# EAGLE board Protein (EAGLE 6.3), part 1 of 2
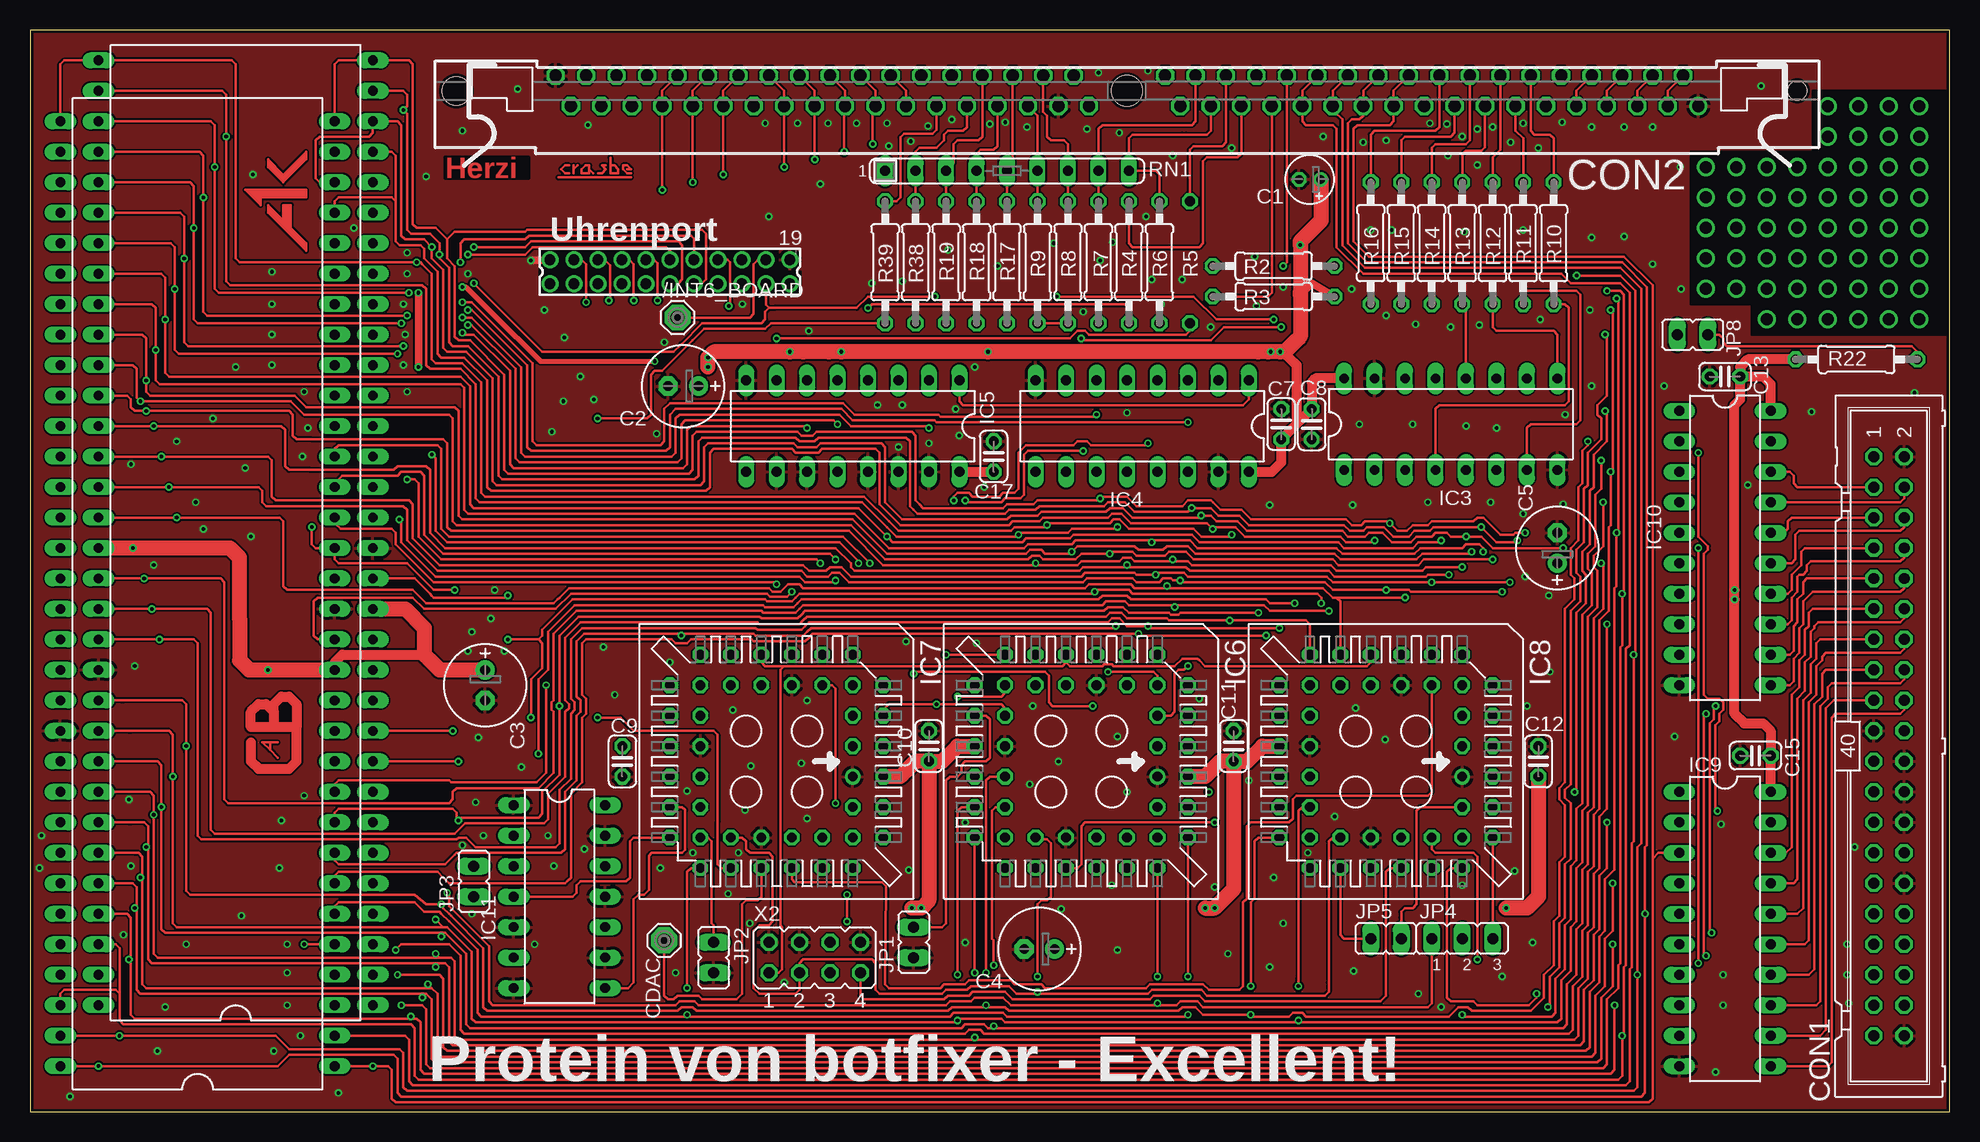
[diagram p6: board, top side]
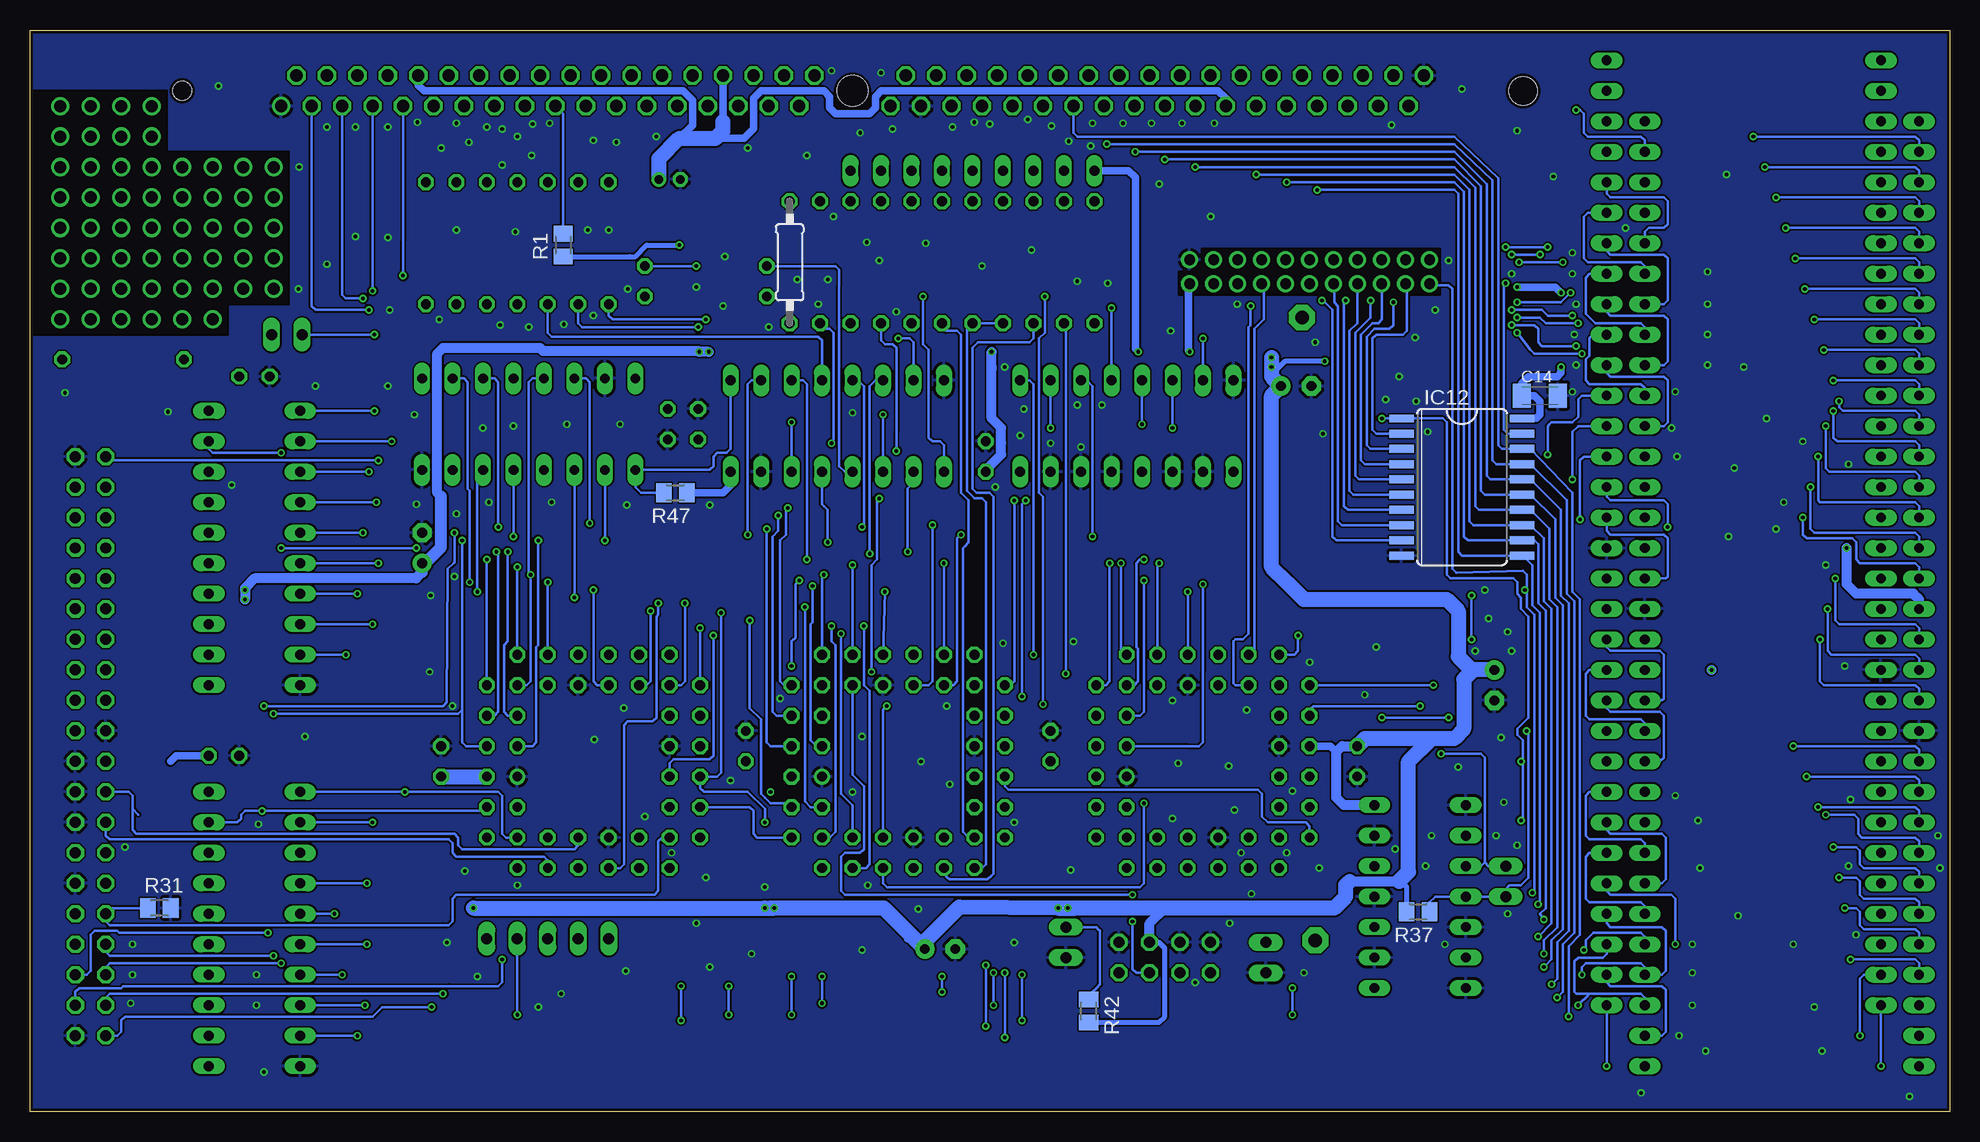
[diagram p7: board, bottom side, seen from below]

Size 160 x 90.16 mm. Coordinates in mm from the lower left corner, seen from the top.
Outline: 0,0 160,0 160,90.16 0,90.16 0,0
Copper layers (1*16): Top 0.035mm / dielectric 1.5mm / Bottom 0.035mm
Design rules "Fusion_eagle_rule_v1.1": minimum track width 6mil, minimum drill 12mil, track to track 6mil, track to pad 6mil, pad to pad 6mil, via to via 6mil, smd to smd 0mil, copper to edge 10mil, drill to drill 10mil, minimum pad ring 10mil, minimum via ring 6mil, stop-mask expansion 2mil, vias tented up to drill 100mil, thermal gap 10mil

## Footprints (pad centres in the part's own frame; a part is rotated, then mirrored left to right if it is on the bottom)
SE11 = drill 1.118 pad 2.159 octagon: MP 0,0
E1,8-4 = drill 0.711 pad 1.168: + -0.889,0 | drill 0.711 pad 1.168 octagon: - 0.889,0
E2,5-7 = drill 0.813 pad 1.6: + -1.27,0 | drill 0.813 pad 1.6 octagon: - 1.27,0
C025-024X044 = drill 0.813 octagon: 1 -1.27,0; 2 1.27,0
C1206K = smd 1.5 x 2: 1 -1.5,0; 2 1.5,0
ML40 = drill 0.914 octagon: 1 -24.13,-1.27; 2 -24.13,1.27; 3 -21.59,-1.27; 4 -21.59,1.27; 5 -19.05,-1.27; 6 -19.05,1.27; 7 -16.51,-1.27; 8 -16.51,1.27; 9 -13.97,-1.27; 10 -13.97,1.27; 11 -11.43,-1.27; 12 -11.43,1.27; 13 -8.89,-1.27; 14 -8.89,1.27; 15 -6.35,-1.27; 16 -6.35,1.27; 17 -3.81,-1.27; 18 -3.81,1.27; 19 -1.27,-1.27; 20 -1.27,1.27; 21 1.27,-1.27; 22 1.27,1.27; 23 3.81,-1.27; 24 3.81,1.27; 25 6.35,-1.27; 26 6.35,1.27; 27 8.89,-1.27; 28 8.89,1.27; 29 11.43,-1.27; 30 11.43,1.27; 31 13.97,-1.27; 32 13.97,1.27; 33 16.51,-1.27; 34 16.51,1.27; 35 19.05,-1.27; 36 19.05,1.27; 37 21.59,-1.27; 38 21.59,1.27; 39 24.13,-1.27; 40 24.13,1.27
73826962 = drill 1.016: 1 47.625,-1.27 | drill 1.016 octagon: 2 46.355,1.27; 3 45.085,-1.27; 4 43.815,1.27; 5 42.545,-1.27; 6 41.275,1.27; 7 40.005,-1.27; 8 38.735,1.27; 9 37.465,-1.27; 10 36.195,1.27; 11 34.925,-1.27; 12 33.655,1.27; 13 32.385,-1.27; 14 31.115,1.27; 15 29.845,-1.27; 16 28.575,1.27; 17 27.305,-1.27; 18 26.035,1.27; 19 24.765,-1.27; 20 23.495,1.27; 21 22.225,-1.27; 22 20.955,1.27; 23 19.685,-1.27; 24 18.415,1.27; 25 17.145,-1.27; 26 15.875,1.27; 27 14.605,-1.27; 28 13.335,1.27; 29 12.065,-1.27; 30 10.795,1.27; 31 9.525,-1.27; 32 8.255,1.27; 33 6.985,-1.27; 34 5.715,1.27; 35 4.445,-1.27; 36 3.175,1.27; 37 -3.175,-1.27; 38 -4.445,1.27; 39 -5.715,-1.27; 40 -6.985,1.27; 41 -8.255,-1.27; 42 -9.525,1.27; 43 -10.795,-1.27; 44 -12.065,1.27; 45 -13.335,-1.27; 46 -14.605,1.27; 47 -15.875,-1.27; 48 -17.145,1.27; 49 -18.415,-1.27; 50 -19.685,1.27; 51 -20.955,-1.27; 52 -22.225,1.27; 53 -23.495,-1.27; 54 -24.765,1.27; 55 -26.035,-1.27; 56 -27.305,1.27; 57 -28.575,-1.27; 58 -29.845,1.27; 59 -31.115,-1.27; 60 -32.385,1.27; 61 -33.655,-1.27; 62 -34.925,1.27; 63 -36.195,-1.27; 64 -37.465,1.27; 65 -38.735,-1.27; 66 -40.005,1.27; 67 -41.275,-1.27; 68 -42.545,1.27; 69 -43.815,-1.27; 70 -45.085,1.27; 71 -46.355,-1.27; 72 -47.625,1.27 | hole 2.362: -55.88,0 | hole 1.575: 55.88,0 | hole 2.54: 0,0
DIL64 = drill 0.813 long: 1 -39.37,-11.43; 2 -36.83,-11.43; 3 -34.29,-11.43; 4 -31.75,-11.43; 5 -29.21,-11.43; 6 -26.67,-11.43; 7 -24.13,-11.43; 8 -21.59,-11.43; 9 -19.05,-11.43; 10 -16.51,-11.43; 11 -13.97,-11.43; 12 -11.43,-11.43; 13 -8.89,-11.43; 14 -6.35,-11.43; 15 -3.81,-11.43; 16 -1.27,-11.43; 17 1.27,-11.43; 18 3.81,-11.43; 19 6.35,-11.43; 20 8.89,-11.43; 21 11.43,-11.43; 22 13.97,-11.43; 23 16.51,-11.43; 24 19.05,-11.43; 25 21.59,-11.43; 26 24.13,-11.43; 27 26.67,-11.43; 28 29.21,-11.43; 29 31.75,-11.43; 30 34.29,-11.43; 31 36.83,-11.43; 32 39.37,-11.43; 33 39.37,11.43; 34 36.83,11.43; 35 34.29,11.43; 36 31.75,11.43; 37 29.21,11.43; 38 26.67,11.43; 39 24.13,11.43; 40 21.59,11.43; 41 19.05,11.43; 42 16.51,11.43; 43 13.97,11.43; 44 11.43,11.43; 45 8.89,11.43; 46 6.35,11.43; 47 3.81,11.43; 48 1.27,11.43; 49 -1.27,11.43; 50 -3.81,11.43; 51 -6.35,11.43; 52 -8.89,11.43; 53 -11.43,11.43; 54 -13.97,11.43; 55 -16.51,11.43; 56 -19.05,11.43; 57 -21.59,11.43; 58 -24.13,11.43; 59 -26.67,11.43; 60 -29.21,11.43; 61 -31.75,11.43; 62 -34.29,11.43; 63 -36.83,11.43; 64 -39.37,11.43
DIL16 = drill 0.813 long: 1 -8.89,-3.81; 2 -6.35,-3.81; 3 -3.81,-3.81; 4 -1.27,-3.81; 5 1.27,-3.81; 6 3.81,-3.81; 7 6.35,-3.81; 8 8.89,-3.81; 9 8.89,3.81; 10 6.35,3.81; 11 3.81,3.81; 12 1.27,3.81; 13 -1.27,3.81; 14 -3.81,3.81; 15 -6.35,3.81; 16 -8.89,3.81
PLCC-S44 = drill 0.813: 1 1.27,6.35 | drill 0.813 octagon: 2 -1.27,8.89; 3 -1.27,6.35; 4 -3.81,8.89; 5 -3.81,6.35; 6 -6.35,8.89; 7 -8.89,6.35; 8 -6.35,6.35; 9 -8.89,3.81; 10 -6.35,3.81; 11 -8.89,1.27; 12 -6.35,1.27; 13 -8.89,-1.27; 14 -6.35,-1.27; 15 -8.89,-3.81; 16 -6.35,-3.81; 17 -8.89,-6.35; 18 -6.35,-8.89; 19 -6.35,-6.35; 20 -3.81,-8.89; 21 -3.81,-6.35; 22 -1.27,-8.89; 23 -1.27,-6.35; 24 1.27,-8.89; 25 1.27,-6.35; 26 3.81,-8.89; 27 3.81,-6.35; 28 6.35,-8.89; 29 8.89,-6.35; 30 6.35,-6.35; 31 8.89,-3.81; 32 6.35,-3.81; 33 8.89,-1.27; 34 6.35,-1.27; 35 8.89,1.27; 36 6.35,1.27; 37 8.89,3.81; 38 6.35,3.81; 39 8.89,6.35; 40 6.35,8.89; 41 6.35,6.35; 42 3.81,8.89; 43 3.81,6.35; 44 1.27,8.89
DIL20 = drill 0.813 long: 1 -11.43,-3.81; 2 -8.89,-3.81; 3 -6.35,-3.81; 4 -3.81,-3.81; 5 -1.27,-3.81; 6 1.27,-3.81; 7 3.81,-3.81; 8 6.35,-3.81; 9 8.89,-3.81; 10 11.43,-3.81; 11 11.43,3.81; 12 8.89,3.81; 13 6.35,3.81; 14 3.81,3.81; 15 1.27,3.81; 16 -1.27,3.81; 17 -3.81,3.81; 18 -6.35,3.81; 19 -8.89,3.81; 20 -11.43,3.81
DIL14 = drill 0.813 long: 1 -7.62,-3.81; 2 -5.08,-3.81; 3 -2.54,-3.81; 4 0,-3.81; 5 2.54,-3.81; 6 5.08,-3.81; 7 7.62,-3.81; 8 7.62,3.81; 9 5.08,3.81; 10 2.54,3.81; 11 0,3.81; 12 -2.54,3.81; 13 -5.08,3.81; 14 -7.62,3.81
SO20W = smd 0.66 x 2.032: 1 -5.715,-5.029; 2 -4.445,-5.029; 3 -3.175,-5.029; 4 -1.905,-5.029; 5 -0.635,-5.029; 6 0.635,-5.029; 7 1.905,-5.029; 8 3.175,-5.029; 9 4.445,-5.029; 10 5.715,-5.029; 11 5.715,5.029; 12 4.445,5.029; 13 3.175,5.029; 14 1.905,5.029; 15 0.635,5.029; 16 -0.635,5.029; 17 -1.905,5.029; 18 -3.175,5.029; 19 -4.445,5.029; 20 -5.715,5.029
JP1 = drill 0.914 long: 1 0,-1.27; 2 0,1.27
JP2 = drill 0.914 long: 1 -2.54,0; 2 0,0; 3 2.54,0
M0805 = smd 1.3 x 1.6: 1 -0.95,0; 2 0.95,0
0207/10 = drill 0.813 octagon: 1 -5.08,0; 2 5.08,0
SIL9 = drill 0.813 long: 1 -10.16,0; 2 -7.62,0; 3 -5.08,0; 4 -2.54,0; 5 0,0; 6 2.54,0; 7 5.08,0; 8 7.62,0; 9 10.16,0
BREAD = drill 1: P$1 0,0; P$2 0,2.54
87758-2216 = drill 0.9 pad 1.27: 1 -10,-1; 2 -10,1; 3 -8,-1; 4 -8,1; 5 -6,-1; 6 -6,1; 7 -4,-1; 8 -4,1; 9 -2,-1; 10 -2,1; 11 0,-1; 12 0,1; 13 2,-1; 14 2,1; 15 4,-1; 16 4,1; 17 6,-1; 18 6,1; 19 8,-1; 20 8,1; 21 10,-1; 22 10,1
JP4Q = drill 0.914 octagon: 1 -3.81,-1.27; 2 -3.81,1.27; 3 -1.27,-1.27; 4 -1.27,1.27; 5 1.27,-1.27; 6 1.27,1.27; 7 3.81,-1.27; 8 3.81,1.27

## Placement (x,y rotation side)
/INT6_BOARD  SE11  [SE11]  53.98,66.2 0 top
C1  [E1,8-4]  106.68,77.71 180 top
C2  [E2,5-7]  54.45,60.48 180 top
C3  [E2,5-7]  37.94,35.56 270 top
C4  [E2,5-7]  84.14,13.57 180 top
C5  [E2,5-7]  127.32,46.99 90 top
C7  100n  [C025-024X044]  104.3,57.31 90 top
C8  100n  [C025-024X044]  106.84,57.31 270 top
C9  100n  [C025-024X044]  49.37,29.21 270 top
C10  100n  [C025-024X044]  74.93,30.48 90 top
C11  100n  [C025-024X044]  100.33,30.48 90 top
C12  100n  [C025-024X044]  125.73,29.21 90 top
C13  100n  [C025-024X044]  141.29,61.28 180 top
C14  100n  [C1206K]  34.13,59.69 0 bottom
C15  100n  [C025-024X044]  143.83,29.69 0 top
C17  100n  [C025-024X044]  80.33,54.61 90 top
CDAC_BOARD  SE11  [SE11]  52.86,14.29 180 top
CON1  [ML40]  154.94,30.48 270 top
CON2  [73826962]  91.44,85.09 0 top
IC1  [DIL64]  17.14,48.26 90 top
IC2  [DIL64]  13.97,43.18 90 top
IC3  74LS157N  [DIL16]  118.43,57.31 0 top
IC4  74LS157N  [DIL16]  92.71,57.15 180 top
IC5  74LS157N  [DIL16]  68.58,57.15 180 top
IC6  M4A5_64/32  [PLCC-S44]  87.63,29.21 270 top
IC7  M4A5_64/32  [PLCC-S44]  62.23,29.21 270 top
IC8  M4A5_64/32  [PLCC-S44]  113.03,29.21 270 top
IC9  74LS245N  [DIL20]  141.29,15.24 270 top
IC10  74LS245N  [DIL20]  141.29,46.99 270 top
IC11  7407  [DIL14]  44.13,17.94 270 top
IC12  74LS245DW  [SO20W]  40.64,52.07 270 bottom
JP1  [JP1]  73.66,14.13 0 top
JP2  [JP1]  56.99,12.86 180 top
JP3  [JP1]  36.99,19.21 0 top
JP4  [JP2]  119.38,14.45 0 top
JP5  [JP1]  113.03,14.45 270 top
JP8  [JP1]  138.59,64.77 90 top
R1  [M0805]  115.57,72.23 90 bottom
R2  33R  [0207/10]  103.66,70.48 0 top
R3  33R  [0207/10]  103.66,67.94 180 top
R4  33R  [0207/10]  91.6,70.8 90 top
R5  33R  [0207/10]  96.68,70.8 90 bottom
R6  33R  [0207/10]  94.14,70.8 90 top
R7  33R  [0207/10]  89.06,70.8 90 top
R8  33R  [0207/10]  86.52,70.8 90 top
R9  33R  [0207/10]  83.98,70.8 90 top
R10  33R  [0207/10]  127,72.39 90 top
R11  33R  [0207/10]  124.46,72.39 90 top
R12  33R  [0207/10]  121.92,72.39 90 top
R13  33R  [0207/10]  119.38,72.39 90 top
R14  33R  [0207/10]  116.84,72.39 90 top
R15  33R  [0207/10]  114.3,72.39 90 top
R16  33R  [0207/10]  111.76,72.39 90 top
R17  33R  [0207/10]  81.44,70.8 90 top
R18  33R  [0207/10]  78.9,70.8 90 top
R19  33R  [0207/10]  76.36,70.8 90 top
R22  4K7  [0207/10]  152.24,62.71 0 top
R31  4K7  [M0805]  149.22,16.99 0 bottom
R37  4K7  [M0805]  44.29,16.67 180 bottom
R38  33R  [0207/10]  73.82,70.8 90 top
R39  33R  [0207/10]  71.28,70.8 90 top
R42  4K7  [M0805]  71.75,8.41 270 bottom
R47  4K7  [M0805]  106.2,51.59 180 bottom
RN1  [SIL9]  81.44,78.42 0 top
U$1  A1K  [A1K]  21.11,76.2 90 top
U$2  CRASBE  [CRASBE]  47.15,78.74 0 top
U$3  CAB  [CAB-LOGO]  20,31.43 90 top
U$4  BREAD_2  [BREAD]  157.48,81.28 0 top
U$5  BREAD_2  [BREAD]  152.4,76.2 0 top
U$6  BREAD_2  [BREAD]  152.4,81.28 0 top
U$7  BREAD_2  [BREAD]  149.86,81.28 0 top
U$8  BREAD_2  [BREAD]  154.94,76.2 0 top
U$9  BREAD_2  [BREAD]  154.94,71.12 0 top
U$10  BREAD_2  [BREAD]  157.48,71.12 0 top
U$11  BREAD_2  [BREAD]  157.48,76.2 0 top
U$12  BREAD_2  [BREAD]  154.94,81.28 0 top
U$13  BREAD_2  [BREAD]  152.4,71.12 0 top
U$14  BREAD_2  [BREAD]  149.86,76.2 0 top
U$15  BREAD_2  [BREAD]  147.32,76.2 0 top
U$16  BREAD_2  [BREAD]  139.7,71.12 0 top
U$17  BREAD_2  [BREAD]  144.78,76.2 0 top
U$18  BREAD_2  [BREAD]  149.86,71.12 0 top
U$19  BREAD_2  [BREAD]  144.78,71.12 0 top
U$20  BREAD_2  [BREAD]  147.32,71.12 0 top
U$21  BREAD_2  [BREAD]  142.24,71.12 0 top
U$22  BREAD_2  [BREAD]  152.4,68.58 90 top
U$23  BREAD_2  [BREAD]  147.32,66.04 90 top
U$24  BREAD_2  [BREAD]  147.32,68.58 90 top
U$25  BREAD_2  [BREAD]  152.4,66.04 90 top
U$26  BREAD_2  [BREAD]  157.48,66.04 90 top
U$27  BREAD_2  [BREAD]  142.24,76.2 0 top
U$28  BREAD_2  [BREAD]  139.7,76.2 0 top
U$29  BREAD_2  [BREAD]  157.48,68.58 90 top
U$30  BREAD_2  [BREAD]  142.24,68.58 90 top
X1  87758-2216  [87758-2216]  53.34,70.01 180 top
X2  JTAG  [JP4Q]  65.41,12.86 0 top

## Tracks (layer width: path | path; a pad name or v marks a point on that pad's centre or on a via)
+5V  (via drill 0.3)
  Top 0.406: 74.77,29.05 C10.1 | v105.89,72.23 105.89,68.26 | v36.04,68.74 36.35,68.74 38.58,66.52 42.55,62.55 v52.07,62.55
  Top 0.61: v67.63,63.34 66.6,63.34 | R3.1 106.84,69.06 105.89,68.1 | v32.38,62.07 v32.38,68.26
  Top 0.813: IC9.20 C15.2 145.1,31.75 144.46,32.38 142.88,32.38 142.08,33.18 v142.08,42.7 v142.08,43.5 142.08,58.9 142.56,59.37 C13.1 | IC10.20 145.1,60.64 144.46,61.28 C13.1 | IC4.16 103.5,53.34 104.3,54.13 C7.1 105.33,57.07 | IC3.16 107.16,61.12 106.84,60.8 C8.1 105.33,57.07 | R22.1 143.19,62.71 142.56,62.07 C13.1 | IC5.16 C17.1 | 103.19,63.34 v104.22,63.34 104.46,63.34 105.41,62.39 105.57,62.23 105.57,57.31 105.33,57.07 | v19.84,36.83 21.51,36.83 | v8.57,46.99 13.81,46.99 | IC2.14 25.4,37.47 26.04,38.1 32.86,38.1 33.26,37.7
  Top 1.27: IC2.14 21.51,36.83 v19.84,36.83 18.26,36.83 17.46,37.62 17.46,41.12 17.46,46.2 16.67,46.99 13.81,46.99 v8.57,46.99 IC1.49 | C12.1 125.73,17.94 124.78,16.99 v123.03,16.99 | C11.1 100.33,18.57 v98.74,16.99 v97.95,16.99 | C10.1 74.93,17.62 v74.3,16.99 v73.5,16.99 | C10.1 73.82,29.21 73.03,28.42 72.55,27.94 IC7.44 | C10.1 76.04,29.21 77.31,30.48 IC6.22 | C11.1 99.22,29.21 97.95,27.94 IC6.44 | C11.1 101.44,29.21 102.71,30.48 IC8.22 | v56.52,62.07 v56.52,62.87 56.99,63.34 v63.34,63.34 64.45,63.34 66.6,63.34 v67.63,63.34 v79.85,63.34 102.39,63.34 103.19,63.34 v104.22,63.34 104.62,63.34 105.57,64.29 105.89,64.61 105.89,68.1 105.89,68.26 v105.89,72.23 105.89,72.55 107.63,74.3 107.63,74.61 107.63,77.64 C1.+ | IC1.14 31.27,41.91 32.86,40.32 32.86,38.1 33.26,37.7 34.13,36.83 C3.+
  Bottom 0.203: 63.45,68.9 X1.2
  Bottom 0.406: 65.41,7.93 65.41,7.94 | 65.41,7.94 65.41,10.95 65.41,13.65 65.88,14.13 X2.6 | R1.1 110.02,71.28 109.54,71.28 108.58,72.23 v105.89,72.23 | R42.2 65.88,7.46 65.41,7.94 | R37.2 45.24,18.73 45.8,19.29 | v52.07,62.55 55.4,62.55 56.52,61.44
  Bottom 0.61: IC12.20 34.45,57.78 34.13,58.1 34.13,59.21 34.61,59.69 C14.1 35.63,60.73 35.08,61.28 32.7,61.28 32.38,61.59 v32.38,62.07 | R47.1 102.23,51.59 101.6,52.23 IC4.16 | CON2.10 127.64,85.57 127.16,85.09 105.73,85.09 105.57,85.09 104.78,84.3 104.78,82.23 105.89,81.12 | CON2.59 60.33,84.45 60.96,85.09 89.06,85.09 89.53,84.61 89.53,84.3 89.53,83.66 90.01,83.19 90.17,83.19 92.87,83.19 93.34,83.66 93.34,84.61 93.82,85.09 98.42,85.09 99.06,85.09 99.69,84.45 99.69,81.92 100.49,81.12 104.14,81.12 | IC7.22 51.59,30.48 51.12,30 | CON2.30 102.23,82.55 | 86.84,14.45 86.56,14.72 | v67.63,63.34 67.87,63.58 67.87,77.87 68.42,78.42 RN1.1 | 148.28,29.21 147.8,29.69 C15.2 | 63.45,68.9 63.45,63.45 v63.34,63.34 | v32.38,68.26 32.86,68.74 33.02,68.74 v36.04,68.74
  Bottom 0.813: IC11.14 50.48,25.56 51.12,26.19 51.12,30 50.64,30.48 C9.1 | C5.+ 127.32,45.01 127.79,44.45 141.29,44.45 142.08,43.66 v142.08,43.5 v142.08,42.7 | 50.01,19.21 45.88,19.21 | X2.6 66.67,15.72 65.41,16.99 | v79.85,63.34 79.85,62.07 79.85,61.91 79.85,57.78 79.06,56.99 79.06,55.72 79.06,54.77 80.33,53.5 C17.1 | v103.43,63.34 v104.22,63.34 104.3,63.42 117.24,63.42 117.47,63.66 125.57,63.66 126.05,63.18 126.05,51.59 125.73,51.28 | v19.85,36.83 v19.84,36.83 | IC2.49 2.54,42.7 3.02,43.18 7.78,43.18 8.57,43.97 v8.57,46.99
  Bottom 1.016: 127.32,45.01 127.32,45.48 125.73,47.07 125.73,51.28
  Bottom 1.27: C3.+ 39.69,36.83 39.77,36.75 | 39.77,36.75 40.48,36.04 40.48,31.91 41.27,31.11 43.18,31.11 | 43.18,31.11 48.74,31.11 C9.1 | C12.1 IC8.44 | v123.03,16.99 v98.74,16.99 | v98.74,16.99 98.27,16.99 | 98.27,16.99 v97.95,16.99 88.9,16.99 88.82,16.99 86.56,14.72 C4.+ 85.41,14.21 82.55,17.07 v74.3,16.99 | 50.01,19.21 50.32,18.89 50.32,17.94 51.28,16.99 65.41,16.99 72.87,16.99 | 45.88,19.21 45.8,19.29 45.09,20 45.09,29.21 43.18,31.11 | v98.74,16.99 98.27,16.99 | 72.87,16.99 v73.5,16.99 | v73.5,16.99 v74.3,16.99 | v74.3,16.99 v73.5,16.99 | v73.5,16.99 72.87,16.99 | v56.52,62.87 v56.52,62.07 56.52,61.44 56.52,61.28 C2.+ 56.52,59.69 56.52,45.4 55.24,44.13 53.82,42.7 41.91,42.7 40.96,41.75 40.96,37.94 39.77,36.75 | 102.23,82.55 102.23,81.76 102.87,81.12 104.14,81.12 105.89,81.12 107.57,79.44 C1.+
A1  (via drill 0.3)
  Top 0.203: 30.48,75.88 30.48,79.69 30.16,80.01 IC1.29 | 30.48,75.88 30.48,72.55 30.8,72.23 32.54,72.23 32.86,71.91 32.86,71.12 33.97,70.01 33.97,63.18 34.29,62.87 36.2,62.87 38.1,60.96 38.1,52.07 38.42,51.75 56.36,51.75 56.67,52.07 56.67,54.93 56.99,55.24 63.5,55.24 63.82,54.93 65.72,54.93 66.04,55.24 70.48,55.24 70.8,54.93 70.8,50.64 72.55,48.9 81.6,48.9 81.92,49.21 84.14,49.21 84.45,49.53 85.25,49.53 85.41,49.53 89.85,49.53 90.17,49.85 90.96,49.85 91.76,49.05 98.11,49.05 v98.58,48.58 98.74,48.74 100.49,48.74 101.28,47.94 109.22,47.94 109.7,47.47 111.92,47.47 v112.08,47.62 | IC2.29 25.4,75.88 25.72,76.2 30.16,76.2 30.48,75.88
  Bottom 0.203: v98.58,48.58 98.58,30.8 98.27,30.48 IC6.2 | v112.08,47.62 IC3.2
A2  (via drill 0.3)
  Top 0.203: v127.79,46.99 121.92,46.99 120.97,47.94 v119.7,47.94 118.43,47.94 118.11,48.26 117.16,48.26 116.84,47.94 115.57,47.94 115.09,47.47 113.51,47.47 112.71,48.26 111.6,48.26 111.28,47.94 109.86,47.94 109.38,48.42 101.44,48.42 100.65,49.21 98.9,49.21 98.42,49.69 v97.63,49.69 97.47,49.53 91.92,49.53 91.12,50.32 90.01,50.32 89.69,50.01 85.57,50.01 85.41,50.01 84.3,50.01 83.98,49.69 81.76,49.69 81.44,49.37 72.71,49.37 71.28,50.8 71.28,55.4 70.96,55.72 65.88,55.72 65.56,55.4 63.98,55.4 63.66,55.72 56.52,55.72 56.2,55.4 56.2,52.55 55.88,52.23 38.89,52.23 38.58,52.55 38.58,61.12 36.35,63.34 34.77,63.34 34.45,63.66 34.45,70.17 33.5,71.12 33.5,71.75 v33.5,72.07 32.86,72.71 31.27,72.71 30.96,73.03 30.96,82.23 30.64,82.55 IC1.30 28.57,81.6 28.26,81.28 24.13,81.28 23.81,80.96 23.81,77.79 24.13,77.47 IC2.30 | v139.06,46.99 v139.06,12.38 | v36.99,72.07 41.27,72.07 41.75,72.55 54.05,72.55 54.37,72.23 54.37,69.37 54.05,69.06 53.39,69.06 X1.12
  Bottom 0.203: v97.63,49.69 97.63,48.42 98.11,47.94 98.11,33.34 97.79,33.02 IC6.4 | IC3.5 v119.7,47.94 | v127.79,46.99 v139.06,46.99 | v139.06,12.38 153.35,12.38 153.67,12.06 CON1.35 | v36.99,72.07 v33.5,72.07
A3  (via drill 0.3)
  Top 0.203: v31.11,83.5 31.43,83.82 31.43,84.77 31.11,85.09 IC1.31 | v31.11,83.5 31.27,83.34 | 31.27,83.34 31.43,83.19 31.43,73.5 31.75,73.18 33.34,73.18 34.13,72.39 v34.13,71.44 34.13,71.12 34.92,70.33 34.92,64.14 35.24,63.82 36.51,63.82 39.05,61.28 39.05,53.02 39.37,52.7 55.4,52.7 55.72,53.02 55.72,55.88 56.04,56.2 63.82,56.2 64.14,55.88 65.41,55.88 65.72,56.2 73.03,56.2 73.34,55.88 73.34,50.48 73.66,50.16 73.98,49.85 81.28,49.85 81.6,50.16 83.82,50.16 84.14,50.48 85.57,50.48 85.72,50.48 89.53,50.48 89.85,50.8 91.28,50.8 92.08,50.01 96.52,50.01 v96.84,50.32 98.42,50.32 99.06,49.69 100.81,49.69 101.6,48.9 109.54,48.9 110.01,48.42 111.12,48.42 111.44,48.74 112.87,48.74 113.67,47.94 114.94,47.94 115.41,48.42 116.68,48.42 117,48.74 v120.97,48.74 122.24,47.47 123.83,47.47 v123.98,47.62 | v139.7,13.02 139.54,13.18 139.54,33.02 v139.7,33.18 | v36.51,71.44 41.27,71.44 41.91,72.07 53.02,72.07 53.34,71.75 X1.11 | v31.11,83.5 31.27,83.34
  Bottom 0.203: v123.98,47.62 123.98,33.5 | 123.98,33.5 123.98,30.8 123.67,30.48 IC8.2 | v120.97,48.74 120.97,60.8 121.28,61.12 IC3.11 | IC6.6 97.16,35.56 97.47,35.88 97.47,47.62 97,48.1 97,50.01 v96.84,50.32 | CON1.33 153.67,13.34 153.35,13.02 v139.7,13.02 | v139.7,33.18 124.3,33.18 123.98,33.5 | v36.51,71.44 v34.13,71.44 | IC2.31 25.4,80.96 25.72,81.28 30.16,81.28 30.48,81.6 30.48,83.19 30.8,83.5 v31.11,83.5
A4  (via drill 0.3)
  Top 0.203: IC6.8 93.98,36.35 93.66,36.67 v89.85,36.67 | v140.49,33.81 140.34,33.66 140.34,32.7 140.02,32.38 140.02,15.08 v140.18,14.92 | 34.77,72.71 33.81,73.66 32.23,73.66 31.91,73.98 31.91,87.31 31.59,87.63 IC1.32 25.72,87.63 25.4,87.31 IC2.32 | 34.77,72.71 34.77,71.12 35.4,70.48 35.4,64.61 35.72,64.29 36.67,64.29 39.53,61.44 39.53,53.5 39.85,53.18 54.93,53.18 55.24,53.5 55.24,56.36 55.56,56.67 63.98,56.67 64.29,56.36 65.25,56.36 65.56,56.67 73.5,56.67 73.82,56.36 73.82,50.96 74.14,50.64 74.45,50.32 81.12,50.32 81.44,50.64 83.66,50.64 83.98,50.96 85.72,50.96 85.88,50.96 89.06,50.96 v89.22,51.12 89.38,51.28 91.44,51.28 92.23,50.48 96.04,50.48 96.52,50.96 98.42,50.96 98.58,50.8 99.22,50.16 100.97,50.16 101.76,49.37 109.7,49.37 110.17,48.9 110.97,48.9 111.28,49.21 113.19,49.21 v113.35,49.05 113.98,48.42 114.78,48.42 115.25,48.9 116.52,48.9 116.84,49.21 120.33,49.21 120.65,49.53 121.13,49.53 122.56,48.1 123.67,48.1 123.83,48.26 v124.62,48.26 | 34.77,72.71 35.4,73.34 41.27,73.34 41.43,73.5 56.04,73.5 56.36,73.18 56.36,69.37 56.04,69.06 55.39,69.06 X1.10
  Bottom 0.203: v89.85,36.67 89.85,45.56 89.38,46.04 89.38,50.96 v89.22,51.12 | IC3.14 113.67,61.12 113.35,60.8 113.35,50.01 v113.35,49.05 | v140.49,33.81 125.57,33.81 125.25,34.13 125.17,45.24 124.7,45.72 124.62,45.8 v124.62,48.26 | v140.18,14.92 152.56,14.92 152.72,15.08 154.62,15.08 154.94,14.76 154.94,11.75 155.26,11.43 CON1.36
A5  (via drill 0.3)
  Top 0.203: v100.17,48.1 100.01,47.94 97.63,47.94 97,48.58 91.6,48.58 90.81,49.37 90.33,49.37 90.01,49.05 84.93,49.05 v84.77,48.9 84.61,48.74 82.07,48.74 81.76,48.42 72.39,48.42 71.6,49.21 69.53,51.28 37.94,51.28 37.62,51.59 37.62,60.8 36.04,62.39 33.81,62.39 33.5,62.71 33.5,69.85 32.7,70.64 32.54,70.8 v32.23,70.8 17.46,70.8 17.14,71.12 17.14,87.31 16.83,87.63 IC1.33 2.86,87.63 2.54,87.31 IC2.33 | v35.88,70.8 35.88,72.39 36.2,72.71 41.27,72.71 41.59,73.03 55.09,73.03 55.34,72.77 X1.9
  Bottom 0.203: v84.77,48.9 84.77,35.88 85.09,35.56 IC6.14 | v100.17,48.1 100.17,60.64 99.85,60.96 IC4.2 | v35.88,70.8 v32.23,70.8
A6  (via drill 0.3)
  Top 0.203: v16.35,81.28 16.35,84.77 16.03,85.09 IC1.34 | v16.35,81.28 16.35,80.96 | 16.35,80.96 16.35,69.22 16.67,68.9 32.7,68.9 33.02,68.58 33.02,62.23 33.34,61.91 35.88,61.91 37.15,60.64 37.15,51.12 37.47,50.8 69.37,50.8 71.44,48.74 72.23,47.94 82.23,47.94 v82.39,48.1 82.55,48.26 86.52,48.26 86.84,48.58 90.49,48.58 v90.65,48.74 | v16.35,81.28 16.35,80.96
  Bottom 0.203: v82.39,48.1 82.71,47.78 82.71,35.88 83.03,35.56 IC6.16 | v90.65,48.74 90.49,48.9 90.49,60.48 90.96,60.96 IC4.5 | IC2.34 2.54,80.96 2.86,81.28 v16.35,81.28
A7  (via drill 0.3)
  Top 0.203: v15.4,78.74 15.4,82.23 15.08,82.55 IC1.35 | v15.4,78.74 15.4,78.42 | 15.4,78.42 15.4,68.58 15.72,68.26 v31.59,68.26 | v88.9,58.1 88.74,57.94 75.88,57.94 75.72,58.1 68.74,58.1 67.79,59.05 53.34,59.05 52.86,58.58 52.86,55.88 52.55,55.56 42.23,55.56 41.91,55.88 41.91,62.39 36.83,67.47 v36.04,67.47 | v15.4,78.74 15.4,78.42
  Bottom 0.203: v31.59,68.26 32.38,67.47 v36.04,67.47 | IC4.11 v88.9,58.1 | IC2.35 2.54,78.42 2.86,78.74 v15.4,78.74
A8  (via drill 0.3)
  Top 0.203: v14.45,76.2 14.45,79.69 14.13,80.01 IC1.36 | v14.45,76.2 14.45,75.88 | 14.45,75.88 14.45,66.67 14.76,66.36 v31.43,66.36 | v36.51,66.83 36.83,66.83 41.43,62.23 41.43,55.4 41.75,55.09 53.02,55.09 53.34,55.4 53.34,58.1 53.82,58.58 67.63,58.58 68.58,57.63 75.41,57.63 75.56,57.47 v96.52,57.47 | v14.45,76.2 14.45,75.88
  Bottom 0.203: v31.43,66.36 33.5,66.36 33.97,66.83 v36.51,66.83 | v96.52,57.47 IC4.14 | IC2.36 2.54,75.88 2.86,76.2 v14.45,76.2
A9  (via drill 0.3)
  Top 0.203: v13.65,73.66 13.65,77.15 13.34,77.47 IC1.37 | v13.65,73.66 13.65,73.34 | 13.65,73.34 13.65,66.04 13.97,65.72 v30.96,65.72 | v36.04,66.2 36.83,66.2 40.96,62.07 40.96,54.93 41.27,54.61 53.5,54.61 53.82,54.93 53.82,57.78 54.13,58.1 67.47,58.1 68.42,57.15 74.77,57.15 v74.93,56.99 | v13.65,73.66 13.65,73.34
  Bottom 0.203: v30.96,65.72 33.66,65.72 34.13,66.2 v36.04,66.2 | v74.93,56.99 IC5.2 | IC2.37 2.54,73.34 2.86,73.66 v13.65,73.66
A10  (via drill 0.3)
  Top 0.203: v12.86,71.12 12.86,74.61 12.54,74.93 IC1.38 | v12.86,71.12 12.86,70.8 | 12.86,70.8 12.86,64.14 13.18,63.82 v31.11,63.82 | v36.51,65.56 36.83,65.56 40.48,61.91 40.48,54.45 40.8,54.13 53.98,54.13 54.29,54.45 54.29,57.31 54.61,57.63 66.99,57.63 v67.31,57.31 | v12.86,71.12 12.86,70.8
  Bottom 0.203: v31.11,63.82 33.97,63.82 34.29,64.14 34.29,65.25 34.61,65.56 v36.51,65.56 | v67.31,57.31 IC5.5 | IC2.38 2.54,70.8 2.86,71.12 v12.86,71.12
A11  (via drill 0.3)
  Top 0.203: v12.06,68.58 12.06,72.07 11.75,72.39 IC1.39 | v12.06,68.58 12.06,68.42 | 12.06,68.42 12.06,63.5 12.38,63.18 v30.64,63.18 | v36.04,64.93 36.2,64.77 36.99,64.77 40.01,61.75 40.01,53.98 40.32,53.66 54.45,53.66 54.77,53.98 54.77,56.83 55.09,57.15 64.61,57.15 v64.77,56.99 | v12.06,68.58 12.06,68.42
  Bottom 0.203: v30.64,63.18 34.61,63.18 34.92,63.5 v36.04,64.93 | v64.77,56.99 IC5.6 | IC2.39 2.54,68.26 2.86,68.58 v12.06,68.58
A12  (via drill 0.3)
  Top 0.203: v11.27,66.04 11.27,69.53 10.95,69.85 IC1.40 | v11.27,66.04 11.27,65.72 | 11.27,65.72 11.27,61.59 11.59,61.28 35.88,61.28 36.67,60.48 36.67,50.64 36.99,50.32 69.06,50.32 v71.44,47.94 71.6,47.78 71.91,47.47 82.71,47.47 83.03,47.78 86.68,47.78 87,48.1 96.84,48.1 97.47,47.47 109.06,47.47 109.54,46.99 115.25,46.99 115.73,47.47 117.47,47.47 v117.63,47.62 | v11.27,66.04 11.27,65.72
  Bottom 0.203: v71.44,47.94 71.44,60.48 71.91,60.96 IC5.3 | v117.63,47.62 117.63,38.89 117.79,38.73 117.79,30.8 118.11,30.48 IC8.3 | IC2.40 2.54,65.72 2.86,66.04 v11.27,66.04
A13  (via drill 0.3)
  Top 0.203: v10.48,63.5 10.48,66.99 10.16,67.31 IC1.41 | v10.48,63.5 10.48,63.18 | 10.48,63.18 10.48,60.96 10.79,60.64 35.88,60.64 36.2,60.33 36.2,50.16 36.51,49.85 68.74,49.85 71.6,46.99 74.3,46.99 82.87,46.99 83.19,47.31 86.84,47.31 87.15,47.62 93.34,47.62 v93.5,47.47 93.66,47.62 96.68,47.62 97.31,46.99 108.9,46.99 109.38,46.51 115.41,46.51 115.89,46.99 119.38,46.99 119.7,47.31 120.81,47.31 121.13,46.99 v121.13,46.67 | v10.48,63.5 10.48,63.18
  Bottom 0.203: v93.5,47.47 93.5,50.16 93.82,50.48 93.98,50.64 IC4.13 | IC8.4 121.28,33.02 120.97,33.34 120.97,46.51 v121.13,46.67 | IC2.41 2.54,63.18 2.86,63.5 v10.48,63.5
A14  (via drill 0.3)
  Top 0.203: v120.17,46.67 120.02,46.51 116.05,46.51 115.57,46.04 109.22,46.04 108.74,46.51 97.16,46.51 96.52,47.15 94.77,47.15 94.46,46.83 92.39,46.83 92.08,47.15 91.12,47.15 87.31,47.15 v86.84,46.67 86.68,46.51 84.61,46.51 84.3,46.83 83.34,46.83 83.03,46.51 74.14,46.51 71.44,46.51 68.58,49.37 36.04,49.37 35.72,49.69 35.72,58.42 35.4,58.74 23.02,58.74 22.07,59.69 10,59.69 9.68,60.01 9.68,60.64 | 9.68,60.64 v9.68,60.96 | v9.68,60.96 9.68,64.45 9.37,64.77 IC1.42 | v9.68,60.96 9.68,60.64
  Bottom 0.203: v86.84,46.67 86.84,51.91 86.36,52.39 IC4.10 | v120.17,46.67 120.17,39.21 120.49,38.89 120.49,33.34 120.17,33.02 IC8.5 | IC2.42 2.54,60.64 2.86,60.96 v9.68,60.96
A15  (via drill 0.3)
  Top 0.203: v121.92,46.04 116.2,46.04 115.73,45.56 109.06,45.56 108.58,46.04 97,46.04 96.36,46.67 94.93,46.67 94.61,46.35 92.23,46.35 91.92,46.67 90.33,46.67 90.17,46.67 v90.01,46.51 87.63,46.51 87.15,46.04 84.45,46.04 84.14,46.35 83.5,46.35 83.19,46.04 73.98,46.04 71.28,46.04 68.42,48.9 35.56,48.9 35.24,49.21 35.24,57.78 34.92,58.1 22.86,58.1 21.75,59.21 9.37,59.21 | 9.37,59.21 v9.21,59.21 | v9.21,59.21 8.89,59.53 8.89,61.91 8.57,62.23 5.87,62.23 IC1.43 | v9.21,59.21 9.37,59.21
  Bottom 0.203: v90.01,46.51 90.01,46.83 90.01,60.48 89.53,60.96 IC4.6 | v121.92,46.04 IC8.6 | IC2.43 2.54,58.1 2.86,58.42 8.89,58.42 9.21,58.74 v9.21,59.21
A16  (via drill 0.3)
  Top 0.203: v119.38,45.4 116.36,45.4 116.05,45.09 108.9,45.09 108.43,45.56 96.84,45.56 96.52,45.88 95.41,45.88 v95.25,46.04 95.09,45.88 92.08,45.88 91.76,46.2 91.12,46.2 90.81,45.88 87.63,45.88 87.31,45.56 83.98,45.56 v83.82,45.72 83.66,45.56 73.82,45.56 71.12,45.56 68.26,48.42 35.08,48.42 34.77,48.74 34.77,50.48 34.77,51.28 34.77,55.72 34.45,56.04 23.5,56.04 22.23,56.04 21.91,56.36 21.91,56.67 21.91,58.1 21.59,58.42 9.84,58.42 | IC1.44 8.1,59.69 8.41,59.37 8.41,58.74 8.73,58.42 v9.68,58.42 | v9.68,58.42 9.84,58.42 | v9.68,58.42 9.84,58.42
  Bottom 0.203: v83.82,45.72 IC6.15 | v95.25,46.04 95.25,60.64 95.57,60.96 IC4.3 | v119.38,45.4 IC8.7 | IC2.44 2.54,55.56 2.86,55.88 9.37,55.88 9.68,56.2 v9.68,58.42
A17  (via drill 0.3)
  Top 0.203: v118.27,44.77 116.52,44.77 116.36,44.61 108.74,44.61 108.27,45.09 96.68,45.09 96.36,45.4 94.77,45.4 94.46,45.4 93.5,45.4 91.6,45.4 v91.44,45.56 91.28,45.4 89.69,45.4 87.79,45.4 87.47,45.09 73.66,45.09 73.5,45.09 70.96,45.09 70.48,45.09 68.74,45.09 68.42,45.4 68.42,45.72 67.15,46.99 34.61,46.99 33.34,48.26 33.34,50.01 33.34,50.64 33.34,53.5 33.02,53.82 32.38,53.82 32.23,53.82 30.64,53.82 30.32,53.5 23.34,53.5 21.59,53.5 21.27,53.82 21.27,56.83 20.95,57.15 10.48,57.15 | 10.48,57.15 v10.32,57.15 | v10.32,57.15 IC1.45 | v10.32,57.15 10.48,57.15
  Bottom 0.203: v91.44,45.56 IC6.9 | IC8.8 118.59,35.56 118.27,35.88 v118.27,44.77 118.43,44.93 118.43,60.8 118.11,61.12 IC3.13 | IC2.45 2.54,53.02 2.86,53.34 10,53.34 10.32,53.66 v10.32,57.15
A18  (via drill 0.3)
  Top 0.203: v123.35,44.13 v116.84,44.13 108.58,44.13 108.11,44.61 107.95,44.61 107.79,44.61 96.52,44.61 96.2,44.93 93.98,44.93 v93.82,44.77 93.66,44.77 92.23,44.77 92.08,44.93 91.92,44.93 89.53,44.93 87.95,44.93 87.63,44.61 73.5,44.61 73.18,44.61 70.96,44.61 70.64,44.61 68.42,44.61 67.63,45.4 66.67,45.4 66.36,45.09 64.93,45.09 64.45,45.56 34.13,45.56 31.91,47.78 31.91,50.64 31.59,50.96 21.59,50.96 20.48,50.96 20.16,51.28 20.16,54.29 19.84,54.61 11.11,54.61 | IC1.46 v10.95,54.61 | v10.95,54.61 11.11,54.61 | v10.95,54.61 11.11,54.61
  Bottom 0.203: v93.82,44.77 93.98,44.61 IC6.7 | IC8.9 v116.84,44.13 | v123.35,44.13 123.35,51.75 123.51,51.91 123.51,60.8 123.83,61.12 IC3.10 | IC2.46 2.54,50.48 2.86,50.8 10.79,50.8 10.95,50.96 v10.95,54.61
A19  (via drill 0.3)
  Top 0.203: v96.52,37.15 96.2,36.83 95.73,36.83 95.41,36.51 95.41,33.34 95.09,33.02 IC6.5 | v122.71,43.34 115.09,43.34 114.94,43.5 v113.03,43.5 108.58,43.5 107.95,44.13 96.04,44.13 v95.89,44.29 95.25,44.29 95.09,44.45 94.46,44.45 94.14,44.13 92.23,44.13 91.92,44.45 90.01,44.45 89.53,44.45 88.11,44.45 87.79,44.13 73.34,44.13 73.03,44.13 71.12,44.13 70.8,44.13 68.26,44.13 67.47,44.93 66.83,44.93 66.52,44.61 64.77,44.61 64.29,45.09 33.97,45.09 31.43,47.62 31.43,50.16 31.11,50.48 22.38,50.48 19.68,50.48 19.37,50.8 19.37,51.75 19.05,52.07 11.75,52.07 | IC1.47 v11.59,52.07 | v11.59,52.07 11.75,52.07 | v11.59,52.07 11.75,52.07
  Bottom 0.203: v95.89,44.29 96.2,43.97 96.2,39.53 96.52,39.21 v96.52,37.15 | IC8.14 112.71,35.56 113.03,35.88 v113.03,43.5 | v122.71,43.34 122.71,53.02 IC3.6 | IC2.47 2.54,47.94 2.86,48.26 11.27,48.26 11.59,48.58 v11.59,52.07
A20  (via drill 0.3)
  Top 0.203: 108.9,42.86 108.58,42.86 107.79,43.66 101.6,43.66 101.44,43.66 96.04,43.66 95.89,43.66 94.93,43.66 v94.77,43.81 94.61,43.66 92.08,43.66 91.76,43.97 89.69,43.97 89.53,43.97 88.27,43.97 87.95,43.66 73.18,43.66 73.03,43.66 71.44,43.66 70.96,43.66 64.45,43.66 64.14,43.97 63.18,43.97 62.55,43.34 61.91,43.34 61.59,43.66 44.93,43.66 44.13,42.86 43.97,42.7 43.66,42.39 33.02,42.39 31.91,43.5 21.43,43.5 21.11,43.81 21.11,49.21 20.8,49.53 12.38,49.53 | 108.9,42.86 109.22,42.86 v114.62,42.86 | IC8.15 109.22,42.55 108.9,42.86 | IC1.48 v12.22,49.53 | v12.22,49.53 12.38,49.53 | v12.22,49.53 12.38,49.53
  Bottom 0.203: IC6.3 94.46,30.48 94.93,30.96 94.93,40.64 94.77,40.8 v94.77,43.81 | v114.62,42.86 IC3.3 | IC2.48 2.54,45.4 2.86,45.72 7.46,45.72 7.78,46.04 7.78,47.47 8.1,47.78 11.91,47.78 12.22,48.1 v12.22,49.53
A21  (via drill 0.3)
  Top 0.203: v108.27,41.75 103.35,41.75 102.87,42.23 102.71,42.23 101.92,42.23 101.76,42.23 95.57,42.23 v95.41,42.07 95.25,42.23 91.6,42.23 91.28,42.55 89.69,42.55 89.38,42.23 72.71,42.23 72.39,42.23 71.75,42.23 71.44,42.23 64.45,42.23 64.14,41.91 63.82,41.59 61.12,41.59 60.96,41.75 45.56,41.75 43.66,39.85 43.66,34.29 43.5,34.13 43.5,33.5 43.66,33.34 43.66,28.26 42.39,26.99 35.56,26.99 35.24,26.67 35.24,26.04 34.92,25.72 16.51,25.72 16.19,26.04 16.19,44.13 15.88,44.45 9.84,44.45 | 9.84,44.45 v9.53,44.45 | v9.53,44.45 IC1.50 | v9.53,44.45 9.84,44.45
  Bottom 0.203: v95.41,42.07 95.41,25.88 94.93,25.4 IC6.43 | v108.27,41.75 108.27,35.88 108.58,35.56 IC8.16 | IC2.50 2.54,40.32 2.86,40.64 9.21,40.64 9.53,40.96 v9.53,44.45
A22  (via drill 0.3)
  Top 0.203: IC8.17 106.68,40.64 106.36,40.96 v100.01,40.96 96.04,40.96 95.89,40.96 94.93,40.96 94.77,41.12 91.44,41.12 90.96,41.59 90.01,41.59 89.69,41.27 64.77,41.27 64.45,40.96 64.14,40.64 62.23,40.64 60.8,40.64 60.64,40.8 45.88,40.8 44.61,39.53 44.61,34.29 44.93,33.97 44.93,33.66 44.61,33.34 44.61,27.94 43.18,26.51 43.18,24.37 42.86,24.05 36.27,24.05 35.4,23.18 15.4,23.18 15.08,23.5 15.08,41.59 14.76,41.91 10.32,41.91 | 10.32,41.91 v10.16,41.91 | v10.16,41.91 IC1.51 | v10.16,41.91 10.32,41.91
  Bottom 0.203: IC6.42 96.84,25.72 98.27,25.72 98.74,26.19 99.06,26.51 99.06,32.7 100.01,33.66 v100.01,40.96 | IC2.51 2.54,37.78 2.86,38.1 9.84,38.1 10.16,38.42 v10.16,41.91
A23  (via drill 0.3)
  Top 0.203: v104.14,40.32 103.98,40.32 93.34,40.32 v93.19,40.48 91.44,40.48 90.81,41.12 90.17,41.12 89.85,40.8 64.93,40.8 64.61,40.48 64.29,40.16 62.07,40.16 60.64,40.16 60.48,40.32 46.04,40.32 45.09,39.37 45.09,34.45 45.4,34.13 45.4,33.5 45.09,33.18 45.09,27.78 44.13,26.83 44.13,22.38 43.81,22.07 37.15,22.07 36.35,22.86 35.72,22.86 35.56,22.7 14.29,22.7 13.97,23.02 13.97,39.05 13.65,39.37 v10.79,39.37 IC1.52
  Bottom 0.203: v104.14,40.32 IC8.18 | IC6.41 93.34,22.86 92.87,23.34 92.87,38.89 93.19,39.21 v93.19,40.48 | IC2.52 2.54,35.24 2.86,35.56 10.48,35.56 10.79,35.88 v10.79,39.37
AS  (via drill 0.3)
  Top 0.203: v54.77,10.32 54.77,20 55.09,20.32 IC7.29 | v96.52,8.1 96.36,7.94 81.44,7.94 81.12,8.26 76.99,8.26 76.68,7.94 54.93,7.94 v54.77,8.1 54.61,7.94 37.62,7.94 37.31,8.26 37.31,13.49 34.92,15.88 34.29,16.51 34.13,16.67 32.86,16.67 32.07,17.46 25.72,17.46 25.4,17.14 IC2.6 | IC6.40 v96.52,11.27
  Bottom 0.203: v54.77,8.1 v54.77,10.32 | IC6.40 99.38,22.86 99.69,23.18 99.69,25.08 100.01,25.4 IC8.26 | v96.52,11.27 v96.52,8.1 | IC1.6 30,21.59 30.32,21.27 30.32,17.78 30,17.46 25.72,17.46 25.4,17.14 IC2.6
B_DRA0
  Top 0.203: R10.2 127,81.12 126.68,81.44 125.41,81.44 125.09,81.76 CON2.12
B_DRA1
  Top 0.203: CON2.13 123.83,81.76 124.46,81.12 R11.2
B_DRA2
  Top 0.203: R12.2 121.92,79.53 122.56,80.17 CON2.14
B_DRA3
  Top 0.203: R13.2 119.38,79.77 119.7,80.09 120.97,80.09 121.28,80.41 CON2.15
B_DRA4
  Top 0.203: CON2.16 120.02,80.96 119.7,80.64 117.16,80.64 116.84,80.33 R14.2
B_DRA5
  Top 0.203: R15.2 114.3,80.96 114.62,81.28 118.43,81.28 118.75,81.6 CON2.17
B_DRA6
  Top 0.203: CON2.18 117.47,82.07 117.16,81.76 112.08,81.76 111.76,81.44 R16.2
B_DRA7  (via drill 0.3)
  Top 0.203: CON2.28 104.78,70.8 v104.46,70.48
  Bottom 0.203: v104.46,70.48 R2.2
B_DRA8
  Top 0.203: R4.2 91.6,72.39 91.92,72.07 97.47,72.07 97.79,72.39 97.79,79.22 98.11,79.53 100.65,79.53 100.97,79.85 CON2.31
B_DRA9
  Top 0.203: CON2.32 99.69,80.8 99.38,80.49 97,80.49 96.68,80.17 R5.2
B_LCAS/CAS0
  Top 0.203: CON2.40 84.45,83.34 84.77,83.03 84.77,81.28 85.09,80.96 86.2,80.96 86.52,80.64 RN1.7 R8.2
B_LCAS/CAS1
  Top 0.203: CON2.41 83.98,83.03 RN1.6 R9.2
B_RAS0
  Top 0.203: CON2.44 79.38,81.28 79.06,80.96 77.31,80.96 76.99,80.64 76.99,79.06 76.83,78.9 RN1.3 R19.2
B_RAS1
  Top 0.203: CON2.45 78.11,82.07 77.79,81.76 76.52,81.76 76.2,81.44 76.2,80.96 75.56,80.33 74.14,80.33 73.82,80.01 RN1.2 R38.2
B_RAS2
  Top 0.203: R7.2 RN1.8 89.06,81.92 89.38,82.23 96.84,82.23 97.16,82.55 CON2.34
B_RAS3
  Top 0.203: R6.2 94.14,78.11 93.82,78.42 RN1.9 91.6,81.12 91.92,81.44 96.04,81.44 96.36,81.44 98.11,81.44 98.42,81.76 CON2.33
B_RW
  Top 0.203: CON2.47 75.56,81.84 75.25,81.52 72.87,81.52 72.55,81.2 72.55,76.2 72.23,75.88 R39.2
B_UCAS/CAS2
  Top 0.203: CON2.43 80.64,80.49 80.33,80.17 79.22,80.17 78.9,79.85 RN1.4 R18.2
B_UCAS/CAS3
  Top 0.203: CON2.42 81.92,79.38 81.92,78.9 RN1.5 R17.2
BERR
  Bottom 0.203: IC1.22 28.57,61.59 28.26,61.28 23.81,61.28 23.5,60.96 23.5,57.47 23.81,57.15 IC2.22
BG
  Bottom 0.203: IC1.11 28.57,33.66 28.26,33.34 24.13,33.34 23.81,33.02 23.81,29.53 24.13,29.21 IC2.11
BGACK
  Bottom 0.203: IC1.12 30,36.83 30.32,36.51 30.32,33.02 30,32.7 25.72,32.7 25.4,32.38 IC2.12
BR
  Bottom 0.203: IC2.13 23.97,34.29 23.81,34.45 23.81,38.1 24.13,38.42 28.26,38.42 28.57,38.73 IC1.13
CDAC
  Top 0.203: CDAC_BOARD.MP 52.86,9.68 53.18,9.37 53.66,9.37 53.98,9.68 55.72,9.68 56.04,9.37 58.9,9.37 59.37,9.84 59.37,17.3 59.69,17.62 60.64,17.62 60.96,17.94 IC7.33
CHOICE_RESET  (via drill 0.3)
  Top 0.203: v119.38,8.1 119.54,7.94 126.84,7.94 127.16,8.26 127.16,11.11 127.95,11.91 127.95,15.56 128.43,16.03 128.43,20.48 128.91,20.95 128.91,25.24 129.38,25.72 129.38,41.43 130.18,42.23 130.18,44.93 129.86,45.24 129.86,46.51 130.49,47.15 130.49,51.44 130.97,51.91 v130.97,54.29
  Bottom 0.203: JP4.2 v119.38,8.1 | v130.97,54.29 153.35,54.29 CON1.1
CLOCK_CPU  (via drill 0.3)
  Top 0.203: 42.39,39.37 42.7,39.05 42.7,36.99 41.75,36.04 v41.75,32.86 | IC7.31 57.63,20.32 57.31,20.64 57.31,24.13 57.31,31.43 56.99,31.75 50.32,31.75 49.21,32.86 v47.31,32.86 | 42.39,39.37 42.7,39.69 42.7,40.16 45.24,42.7 61.28,42.7 61.44,42.55 62.87,42.55 63.5,42.55 63.82,42.86 64.14,43.18 71.12,43.18 71.44,43.18 72.71,43.18 73.03,43.18 88.58,43.18 v88.74,43.34 88.9,43.5 91.6,43.5 91.92,43.18 107.31,43.18 107.63,42.86 v107.63,42.39 | 42.39,39.37 v39.85,39.37 | IC1.15 32.07,44.45 33.34,43.18 33.5,43.02 33.66,42.86 39.69,42.86 v39.85,43.02
  Bottom 0.203: v41.75,32.86 v47.31,32.86 | IC6.11 v88.74,43.34 | IC8.33 110.81,20.32 110.49,20.64 110.49,32.23 110.17,32.54 108.11,32.54 107.79,32.86 107.79,41.27 107.63,41.43 v107.63,42.39 | v39.85,39.37 v39.85,43.02
CLOCK_OSZ
  Top 0.203: IC11.8 49.85,10.32 50.32,10.79 50.32,17.7 50.72,18.1 51.2,18.1 51.59,18.49 51.59,21.35 51.83,21.59 54.37,21.59 54.61,21.83 54.61,25.16 54.37,25.4 IC7.26
CLOCK_SOCKET  (via drill 0.3)
  Top 0.203: v63.5,43.34 63.34,43.18 63.1,42.94 61.67,42.94 61.44,43.18 45.09,43.18 43.81,41.91 32.86,41.91 31.91,42.86 23.97,42.86 23.65,42.55 23.65,39.69 23.97,39.37 IC2.15
  Bottom 0.203: v63.5,43.34 IC7.11
D0  (via drill 0.3)
  Top 0.203: v131.76,66.83 131.92,66.67 131.92,53.5 v131.76,53.34 131.76,48.9 131.6,48.74 131.6,41.75 130.81,40.96 130.81,25.24 130.33,24.77 130.33,20.48 129.86,20 129.86,15.56 129.38,15.08 129.38,11.27 128.59,10.48 128.59,6.83 128.27,6.51 79.53,6.51 79.22,6.83 78.26,6.83 77.95,6.51 36.2,6.51 35.88,6.83 35.88,13.02 34.92,13.97 30.96,13.97 v30.48,13.49 | CON2.3 136.53,85.09 CON2.2 | IC2.5 v22.86,13.97
  Bottom 0.203: v131.76,53.34 IC10.3 | v131.76,66.83 136.21,66.83 136.53,67.15 CON2.3 | IC2.5 25.4,14.61 25.72,14.92 29.69,14.92 30.32,14.29 30.32,13.65 v30.48,13.49 | IC1.5 28.57,18.41 28.26,18.1 23.97,18.1 23.65,18.1 23.18,18.1 22.86,17.78 v22.86,13.97
D1  (via drill 0.3)
  Top 0.203: v132.24,67.79 132.4,67.63 132.4,48.42 v132.24,48.26 132.24,43.81 132.08,43.66 132.08,20.16 131.29,19.37 131.29,15.08 130.81,14.61 130.81,10.79 130.02,10 130.02,5.4 129.7,5.08 34.77,5.08 34.45,5.4 34.45,11.11 34.13,11.43 v30.64,11.43 | CON2.5 133.99,85.09 CON2.4
  Bottom 0.203: v132.24,48.26 IC10.5 | v132.24,67.79 133.67,67.79 133.99,68.1 CON2.5 | IC1.4 28.57,15.72 28.26,15.4 23.97,15.4 23.65,15.08 23.65,11.75 23.97,11.43 IC2.4 25.4,12.06 25.72,12.38 30.32,12.38 30.64,12.06 v30.64,11.43
D2  (via drill 0.3)
  Top 0.203: v131.44,68.42 132.56,68.42 132.87,68.1 132.87,43.34 v132.72,43.18 132.72,38.89 132.56,38.73 132.56,12.38 132.4,12.22 132.4,10.32 131.44,9.37 131.44,3.97 131.13,3.65 33.34,3.65 33.02,3.97 33.02,8.57 32.7,8.89 v30.96,8.89 | CON2.7 131.44,85.09 CON2.6
  Bottom 0.203: v132.72,43.18 IC10.7 | v131.44,68.42 131.44,73.03 131.44,81.76 CON2.7 | IC1.3 28.57,13.18 28.89,12.86 30.96,12.86 31.27,12.54 31.27,10 31.11,9.84 30,9.84 | 30,9.84 25.72,9.84 25.4,9.53 IC2.3 | v30.96,8.89 30.64,9.21 30.32,9.53 30,9.84
D3  (via drill 0.3)
  Top 0.203: v128.91,69.69 132.56,69.69 133.83,68.42 133.83,38.26 v133.67,38.1 133.67,22.54 133.51,22.38 133.51,12.06 133.35,11.91 133.35,2.54 133.03,2.22 31.91,2.22 31.59,2.54 31.59,6.03 31.27,6.35 IC2.2 | CON2.9 128.91,85.09 CON2.8
  Bottom 0.203: v133.67,38.1 IC10.9 | v128.91,69.69 128.91,71.91 128.91,72.55 CON2.9 | IC1.2 28.57,10.79 28.26,10.48 23.97,10.48 23.65,10.16 23.65,6.67 23.97,6.35 IC2.2
D4  (via drill 0.3)
  Top 0.203: 135.25,21.11 135.25,1.11 134.94,0.79 30.48,0.79 30.16,1.11 30.16,3.49 29.84,3.81 28.89,3.81 | 135.25,21.11 135.25,21.59 135.25,68.9 132.87,71.28 111.6,71.28 110.33,72.55 110.33,81.92 110.65,82.23 113.35,82.23 113.67,82.55 CON2.21 113.67,85.09 CON2.20 | IC9.3 135.73,21.59 135.25,21.11 | 28.89,3.81 v28.57,3.81 | v28.57,3.81 IC2.1 | v28.57,3.81 28.89,3.81
  Bottom 0.203: IC1.1 v28.57,3.81
D5  (via drill 0.3)
  Top 0.203: CON2.22 111.12,85.09 CON2.23 111.12,83.03 110.81,82.71 110.17,82.71 109.86,82.39 109.86,82.07 109.86,72.39 111.44,70.8 132.72,70.8 134.78,68.74 134.78,22.23 134.62,22.07 v134.62,16.51 134.62,1.59 134.3,1.27 30.96,1.27 30.64,1.59 30.64,4.45 30.32,4.76 21.59,4.76 20.64,3.81 v5.71,3.81 | v5.71,3.81 5.56,3.81 | 5.56,3.81 IC2.64 | v5.71,3.81 5.56,3.81
  Bottom 0.203: v134.62,16.51 IC9.5 | IC1.64 v5.71,3.81
D6  (via drill 0.3)
  Top 0.203: CON2.24 108.58,85.09 CON2.25 108.58,83.5 108.74,83.34 109.38,82.71 109.38,82.23 109.38,72.23 111.28,70.33 132.56,70.33 134.3,68.58 134.3,22.38 133.99,22.07 v133.99,11.43 133.99,2.06 133.67,1.75 31.43,1.75 31.11,2.06 31.11,4.92 30.8,5.24 21.59,5.24 20.48,6.35 7.78,6.35 | IC2.63 v7.46,6.35 | v7.46,6.35 7.78,6.35 | v7.46,6.35 7.78,6.35
  Bottom 0.203: v133.99,11.43 IC9.7 | IC1.63 7.14,11.43 7.46,11.11 v7.46,6.35
D7  (via drill 0.3)
  Top 0.203: 7.46,9.84 7.46,13.65 7.14,13.97 IC1.62 | 7.46,9.84 7.46,7.62 7.78,7.3 31.75,7.3 32.07,6.99 32.07,3.02 32.38,2.7 132.4,2.7 132.72,3.02 v132.72,6.35 132.87,6.51 132.87,12.06 133.03,12.22 133.03,38.58 133.35,38.89 133.35,68.26 132.56,69.06 128.43,69.06 127.64,69.85 111.12,69.85 108.9,72.07 108.9,81.92 108.58,82.23 107.63,82.23 107.31,82.23 106.36,82.23 106.05,82.55 CON2.27 106.05,85.09 CON2.26 | IC2.62 2.54,9.84 2.86,10.16 7.14,10.16 7.46,9.84
  Bottom 0.203: v132.72,6.35 IC9.9
D8  (via drill 0.3)
  Top 0.203: v8.26,12.7 8.41,12.86 8.41,16.19 8.1,16.51 IC1.61 | v8.26,12.7 8.33,12.62 | 8.33,12.62 8.41,12.54 8.41,8.1 8.73,7.78 31.91,7.78 | v132.08,8.89 132.08,3.49 131.76,3.17 32.86,3.17 32.54,3.49 32.54,7.46 32.23,7.78 31.91,7.78 | 31.91,7.78 v31.75,7.94 | CON2.49 73.03,85.09 CON2.50 | v8.26,12.7 8.33,12.62
  Bottom 0.203: v132.08,8.89 IC9.8 | CON2.49 73.03,81.6 72.71,81.28 41.27,81.28 37.62,77.79 37.62,55.56 37.31,55.24 IC12.18 34.92,55.24 31.43,51.59 31.43,43.34 30.8,42.7 30.8,14.76 31.75,13.81 v31.75,7.94 | IC2.61 2.54,12.38 2.86,12.7 8.1,12.7 v8.26,12.7
D9  (via drill 0.3)
  Top 0.203: v8.73,16.99 8.89,17.14 8.89,18.73 8.57,19.05 IC1.60 | v8.73,16.99 8.89,16.83 | 8.89,16.83 8.89,10.16 9.21,9.84 33.02,9.84 | 33.02,9.84 33.5,9.37 33.5,4.45 33.81,4.13 130.65,4.13 130.97,4.45 130.97,9.53 131.92,10.48 v131.92,13.97 | v70.25,80.64 70.25,83.58 CON2.51 70.48,85.09 CON2.52 | v32.7,9.53 33.02,9.84 | v8.73,16.99 8.89,16.83
  Bottom 0.203: v131.92,13.97 IC9.6 | v70.25,80.64 41.27,80.64 38.1,77.63 38.1,54.29 37.78,53.98 IC12.17 34.92,53.98 31.91,50.96 31.91,43.18 31.27,42.55 31.27,14.92 32.23,13.97 32.23,10 v32.7,9.53 | IC2.60 2.54,14.92 2.86,15.24 7.14,15.24 7.46,15.56 7.46,16.67 7.78,16.99 v8.73,16.99
D10  (via drill 0.3)
  Top 0.203: v9.21,19.53 9.37,19.68 9.37,21.27 9.05,21.59 8.89,21.59 | v9.21,19.53 9.37,19.37 | 9.37,19.37 9.37,10.64 9.68,10.32 33.5,10.32 | 33.5,10.32 33.97,9.84 33.97,4.92 34.29,4.6 130.18,4.6 130.49,4.92 130.49,9.68 131.29,10.48 131.29,14.45 131.92,15.08 v131.92,19.05 | v67.87,80.01 67.87,83.74 CON2.53 67.94,85.09 CON2.54 | v33.18,10.64 33.5,10.32 | 8.89,21.59 8.73,21.59 | 8.73,21.59 IC1.59 | 8.73,21.59 8.89,21.59 | v9.21,19.53 9.37,19.37
  Bottom 0.203: v131.92,19.05 IC9.4 | v67.87,80.01 41.27,80.01 38.58,77.31 38.58,53.02 38.26,52.7 IC12.16 34.92,52.7 32.38,50.16 32.38,43.02 31.75,42.39 31.75,15.08 32.7,14.13 32.7,11.11 v33.18,10.64 | IC2.59 2.54,17.46 2.86,17.78 7.14,17.78 7.46,18.1 7.46,19.21 7.78,19.53 v9.21,19.53
D11  (via drill 0.3)
  Top 0.203: 34.13,12.38 10.16,12.38 9.84,12.7 9.84,21.91 v9.68,22.07 9.84,22.23 9.84,23.81 9.53,24.13 8.41,24.13 | 34.13,12.38 34.61,12.38 34.92,12.06 34.92,5.87 35.24,5.56 129.22,5.56 129.54,5.87 129.54,10.16 130.33,10.95 130.33,14.76 130.81,15.24 130.81,19.68 131.44,20.32 v131.44,24.13 | v65.41,79.38 CON2.55 65.41,85.09 CON2.56 | v33.81,12.06 34.13,12.38 | 8.41,24.13 8.26,24.13 | 8.26,24.13 IC1.58 | 8.26,24.13 8.41,24.13
  Bottom 0.203: v131.44,24.13 IC9.2 | v65.41,79.38 41.27,79.38 39.05,77.15 39.05,51.75 38.73,51.44 IC12.15 34.92,51.44 32.86,49.37 32.86,42.86 32.23,42.23 32.23,15.24 33.18,14.29 33.18,12.7 33.66,12.22 v33.81,12.06 | IC2.58 2.54,20 2.86,20.32 7.14,20.32 7.46,20.64 7.46,21.75 7.78,22.07 v9.68,22.07
D12  (via drill 0.3)
  Top 0.203: v10.32,24.77 10.32,26.35 10,26.67 IC1.57 | v10.32,24.77 10.32,24.45 | 10.32,24.45 10.32,13.18 10.64,12.86 34.13,12.86 | 34.13,12.86 35.08,12.86 35.4,12.54 35.4,6.35 35.72,6.03 78.58,6.03 v78.74,6.19 78.9,6.03 128.75,6.03 129.06,6.35 129.06,10.32 129.86,11.11 129.86,14.92 130.33,15.4 130.33,19.84 130.81,20.32 130.81,24.61 131.44,25.24 v131.44,40.64 | IC6.28 v78.74,11.59 | v62.87,78.74 CON2.57 62.87,85.09 CON2.58 | v33.81,13.18 34.13,12.86 | v10.32,24.77 10.32,24.45
  Bottom 0.203: v131.44,40.64 IC10.8 | v78.74,11.59 v78.74,6.19 | v62.87,78.74 41.27,78.74 39.53,76.99 39.53,50.48 39.21,50.16 IC12.14 34.92,50.16 33.34,48.58 33.34,42.7 32.7,42.07 32.7,15.4 33.81,14.29 v33.81,13.18 | IC2.57 2.54,22.54 2.86,22.86 7.3,22.86 7.62,23.18 7.62,24.45 7.94,24.77 v10.32,24.77
D13  (via drill 0.3)
  Top 0.203: 34.45,14.92 11.27,14.92 10.95,15.24 v10.95,25.4 10.95,28.89 10.64,29.21 IC1.56 | 34.45,14.92 34.61,14.92 36.35,13.18 36.35,7.3 36.67,6.99 77.63,6.99 77.95,7.3 79.53,7.3 79.85,6.99 80.17,6.99 v80.33,7.14 80.49,6.99 127.79,6.99 128.11,7.3 128.11,10.64 128.91,11.43 128.91,15.24 129.38,15.72 129.38,20.16 129.86,20.64 129.86,24.92 130.33,25.4 130.33,41.12 131.13,41.91 131.13,45.56 v130.97,45.72 | v80.33,12.22 80.33,14.29 80.17,14.45 80.17,25.08 80.49,25.4 IC6.27 | v57.78,78.11 CON2.61 57.78,85.09 CON2.60 | v34.29,14.61 34.45,14.92
  Bottom 0.203: v80.33,7.14 v80.33,12.22 | IC10.6 v130.97,45.72 | v57.78,78.11 41.27,78.11 40.01,76.83 40.01,49.21 39.69,48.9 IC12.13 34.92,48.9 33.81,47.78 33.81,42.55 33.18,41.91 33.18,15.72 v34.29,14.61 | IC2.56 2.54,25.08 2.86,25.4 v10.95,25.4
D14  (via drill 0.3)
  Top 0.203: v11.91,27.94 11.91,31.43 11.59,31.75 8.41,31.75 | v11.91,27.94 11.91,27.62 | 11.91,27.62 11.91,15.72 12.22,15.4 34.45,15.4 | 34.45,15.4 34.77,15.4 36.83,13.34 36.83,7.78 37.15,7.46 77.15,7.46 v77.31,7.62 77.47,7.78 80.96,7.78 81.28,7.46 105.57,7.46 v105.73,7.62 105.89,7.46 110.33,7.46 110.65,7.46 127.32,7.46 127.64,7.78 127.64,10.95 128.43,11.75 128.43,15.4 128.91,15.88 128.91,20.32 129.38,20.8 129.38,25.08 129.86,25.56 129.86,41.27 130.65,42.07 130.65,45.09 130.33,45.4 130.33,46.35 131.13,47.15 v131.13,50.8 | v77.31,11.43 77.31,25.08 77.63,25.4 IC6.26 | v55.24,77.47 CON2.63 55.24,85.09 CON2.62 | v33.81,16.03 34.45,15.4 | IC8.27 106.05,25.4 105.73,25.08 105.73,11.11 | 105.73,11.11 v105.73,10.48 105.73,11.11 | 8.41,31.75 8.26,31.75 | 8.26,31.75 IC1.55 | 8.26,31.75 8.41,31.75 | v11.91,27.94 11.91,27.62
  Bottom 0.203: v77.31,7.62 v77.31,11.43 | IC10.4 v131.13,50.8 | v55.24,77.47 41.27,77.47 40.48,76.68 40.48,47.94 40.16,47.62 IC12.12 34.61,47.62 34.29,47.31 34.29,42.39 33.66,41.75 33.66,16.99 34.13,16.51 v33.81,16.03 | v105.73,7.62 v105.73,10.48 | IC2.55 2.54,27.62 2.86,27.94 8.1,27.94 v11.91,27.94
D15  (via drill 0.3)
  Top 0.203: v13.02,30.48 13.02,33.97 12.7,34.29 7.78,34.29 | v13.02,30.48 13.02,30 | 13.02,30 13.02,18.41 13.34,18.1 32.07,18.1 33.02,17.3 v34.29,17.3 34.45,16.99 34.92,16.51 35.08,16.35 37.78,13.65 37.78,8.73 38.1,8.41 53.98,8.41 54.29,8.73 55.24,8.73 55.56,8.41 76.52,8.41 76.83,8.73 79.53,8.73 v79.69,8.89 79.85,8.73 81.28,8.73 81.6,8.41 95.73,8.41 96.04,8.73 97.16,8.73 97.79,8.1 v101.76,8.1 101.92,7.94 104.93,7.94 105.25,8.26 106.05,8.26 106.36,7.94 118.27,7.94 119.06,8.73 119.86,8.73 120.17,8.41 125.09,8.41 126.21,9.53 126.21,11.43 127,12.22 127,15.88 127.48,16.35 127.48,20.8 127.95,21.27 127.95,25.56 127.48,26.04 127.48,26.99 127.95,27.46 127.95,41.91 128.75,42.7 128.75,44.45 128.43,44.77 128.43,46.99 129.06,47.62 129.06,52.07 129.38,52.39 129.38,55.09 129.86,55.56 v129.86,55.88 | v79.69,11.59 79.69,27.62 80.01,27.94 IC6.25 | v52.7,76.83 CON2.65 52.7,85.09 CON2.64 | v101.76,10.48 101.76,17.46 102.08,17.78 102.08,22.54 102.39,22.86 IC8.28 | 7.78,34.29 7.62,34.29 | 7.62,34.29 IC1.54 | 7.62,34.29 7.78,34.29 | v13.02,30.48 13.02,30
  Bottom 0.203: v79.69,8.89 v79.69,11.59 | v52.7,76.83 41.27,76.83 40.96,76.52 40.96,46.67 40.64,46.35 IC12.11 35.56,46.35 34.77,45.56 34.77,42.23 34.13,41.59 34.13,17.46 v34.29,17.3 | IC10.2 v129.86,55.88 | v101.76,10.48 v101.76,8.1 | IC2.54 2.54,30.16 2.86,30.48 7.3,30.48 v13.02,30.48
DA0
  Top 0.203: IC10.17 155.89,50.8 156.21,51.12 CON1.4
DA1
  Top 0.203: IC10.15 146.84,45.72 147.16,46.04 147.16,48.1 147.48,48.42 155.89,48.42 156.21,48.74 CON1.6
DA2
  Top 0.203: CON1.8 156.21,46.2 155.89,45.88 148.43,45.88 148.11,45.56 148.11,45.09 147.8,44.77 147.48,44.77 147.32,44.61 147.32,43.34 146.84,42.86 146.84,40.96 146.53,40.64 IC10.13
DA3
  Top 0.203: CON1.10 156.21,43.66 155.89,43.34 148.59,43.34 147.8,42.55 147.8,40.64 147.48,40.32 147.48,38.26 147,37.78 147,35.88 146.69,35.56 IC10.11
DA4
  Top 0.203: IC9.17 147,19.05 147.32,19.37 147.32,34.45 147.96,35.08 147.96,37.47 148.43,37.94 148.43,40.01 148.75,40.32 148.75,40.48 149.07,40.8 155.89,40.8 156.21,41.12 CON1.12
DA5
  Top 0.203: IC9.15 147.96,13.97 148.27,14.29 148.27,34.13 148.91,34.77 148.91,37.15 149.38,37.62 149.38,37.94 149.7,38.26 155.89,38.26 156.21,38.58 CON1.14
DA6
  Top 0.203: IC9.13 148.91,8.89 149.22,9.21 149.22,33.81 149.86,34.45 149.86,35.4 150.18,35.72 155.89,35.72 156.21,36.04 CON1.16
DA7
  Top 0.203: CON1.18 156.21,33.5 155.89,33.18 150.5,33.18 150.18,32.86 150.18,4.13 149.86,3.81 IC9.11
DA8
  Top 0.203: IC9.12 149.22,6.35 149.7,6.83 149.7,33.66 150.34,34.29 CON1.17
DA9
  Top 0.203: IC9.14 148.27,11.43 148.75,11.91 148.75,33.97 149.38,34.61 149.38,36.51 149.7,36.83 CON1.15
DA10
  Top 0.203: IC9.16 147.32,16.51 147.8,16.99 147.8,34.29 148.43,34.92 148.43,37.31 148.91,37.78 148.91,39.05 149.22,39.37 CON1.13
DA11
  Top 0.203: IC9.18 146.37,21.59 146.84,22.07 146.84,34.77 147.48,35.4 147.48,37.62 147.96,38.1 147.96,40.16 148.27,40.48 148.27,41.59 148.59,41.91 CON1.11
DA12
  Top 0.203: CON1.9 148.11,44.45 147.8,44.13 147.8,43.18 147.32,42.7 147.32,40.8 147,40.48 147,38.42 146.69,38.1 IC10.12
DA13
  Top 0.203: CON1.7 147.96,46.99 147.64,46.67 147.64,45.56 146.84,44.77 146.84,43.5 146.53,43.18 IC10.14
DA14
  Top 0.203: IC10.16 146.21,48.26 146.53,48.58 146.53,49.21 146.84,49.53 CON1.5
DA15
  Top 0.203: IC10.18 146.69,53.34 147,53.02 147,52.39 147.32,52.07 CON1.3
DRA0
  Top 0.203: IC3.4 117.16,58.58 117.47,58.9 127.95,58.9 128.27,59.21 128.27,66.99 127.95,67.31 R10.1
DRA1
  Top 0.203: R11.1 124.46,68.1 124.78,68.42 128.91,68.42 129.22,68.1 129.22,57.63 128.91,57.31 125.09,57.31 124.78,56.99 IC3.7
DRA2
  Top 0.203: IC3.9 127.32,64.77 127,65.09 122.24,65.09 121.92,65.41 R12.1
DRA3
  Top 0.203: IC3.12 119.7,66.99 R13.1
DRA4
  Bottom 0.203: IC4.4 93.98,64.29 94.3,64.61 103.82,64.61 110.65,64.61 110.97,64.61 116.36,64.61 116.52,64.61 116.84,64.93 R14.1
DRA5  (via drill 0.3)
  Top 0.203: v87.63,64.45 87.79,64.29 98.42,64.29 99.54,65.41 v104.3,65.41
  Bottom 0.203: v87.63,64.45 86.68,64.45 86.36,64.14 IC4.7 | v104.3,65.41 110.65,65.41 110.97,65.41 113.98,65.41 114.3,65.72 R15.1
DRA6  (via drill 0.3)
  Top 0.203: v85.57,67.94 97,67.94 98.9,66.04 v103.66,66.04